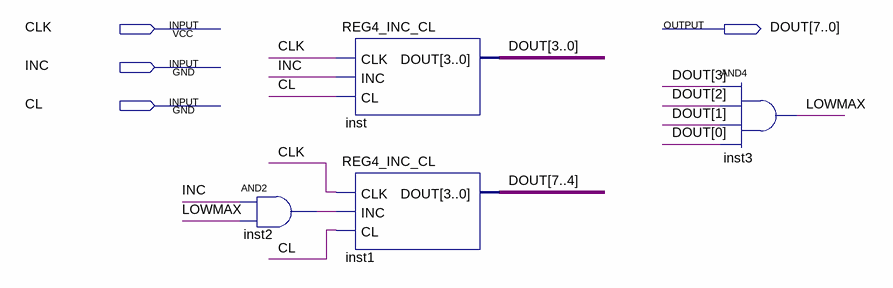
[diagram p0: schematic sheet]
// Quartus schematic REG8_INC_CL.bdf as structural Verilog: 4 symbols, 4 pins
module REG8_INC_CL (
  input  CLK,
  input  INC,
  input  CL,
  output [7:0] DOUT
);

  wire inst2_out, LOWMAX;

  and inst2 (inst2_out, INC, LOWMAX);
  REG4_INC_CL inst (.CLK(CLK), .INC(INC), .CL(CL), .DOUT(DOUT[3:0]));
  REG4_INC_CL inst1 (.CLK(CLK), .INC(inst2_out), .CL(CL), .DOUT(DOUT[7:4]));
  and inst3 (LOWMAX, DOUT[3], DOUT[2], DOUT[1], DOUT[0]);
endmodule
